# EAGLE design multi (EAGLE 9.6.2)
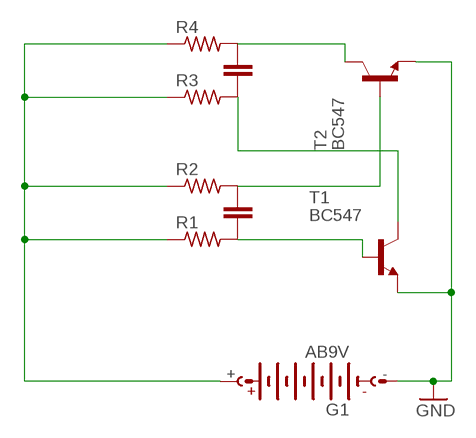
[diagram p0: schematic, sheet 1]

## Parts
G1  AB9V  [AB9V]
R1  R-US_R0805  [R0805]
R2  R-US_R0805  [R0805]
R3  R-US_R0805  [R0805]
R4  R-US_R0805  [R0805]
T1  BC547  [TO92]
T2  BC547  [TO92]

## Nets
GND: G1.- T1.1(E) T2.1(E)
N$1: G1.+ R1.1 R2.1 R3.1 R4.1
N$2: R1.2 T1.2(B)
N$4: R3.2 T1.3(C)
N$5: R2.2 T2.2(B)
N$6: R4.2 T2.3(C)

## Library data of the parts
G1 = battery:AB9V: 9-V BATTERY CLIP
R1-R4 = rcl:R-US_: RESISTOR, American symbol; SPICEPREFIX: R
T1 T2 = transistor:BC547: NPN TRANSISTOR

## Board
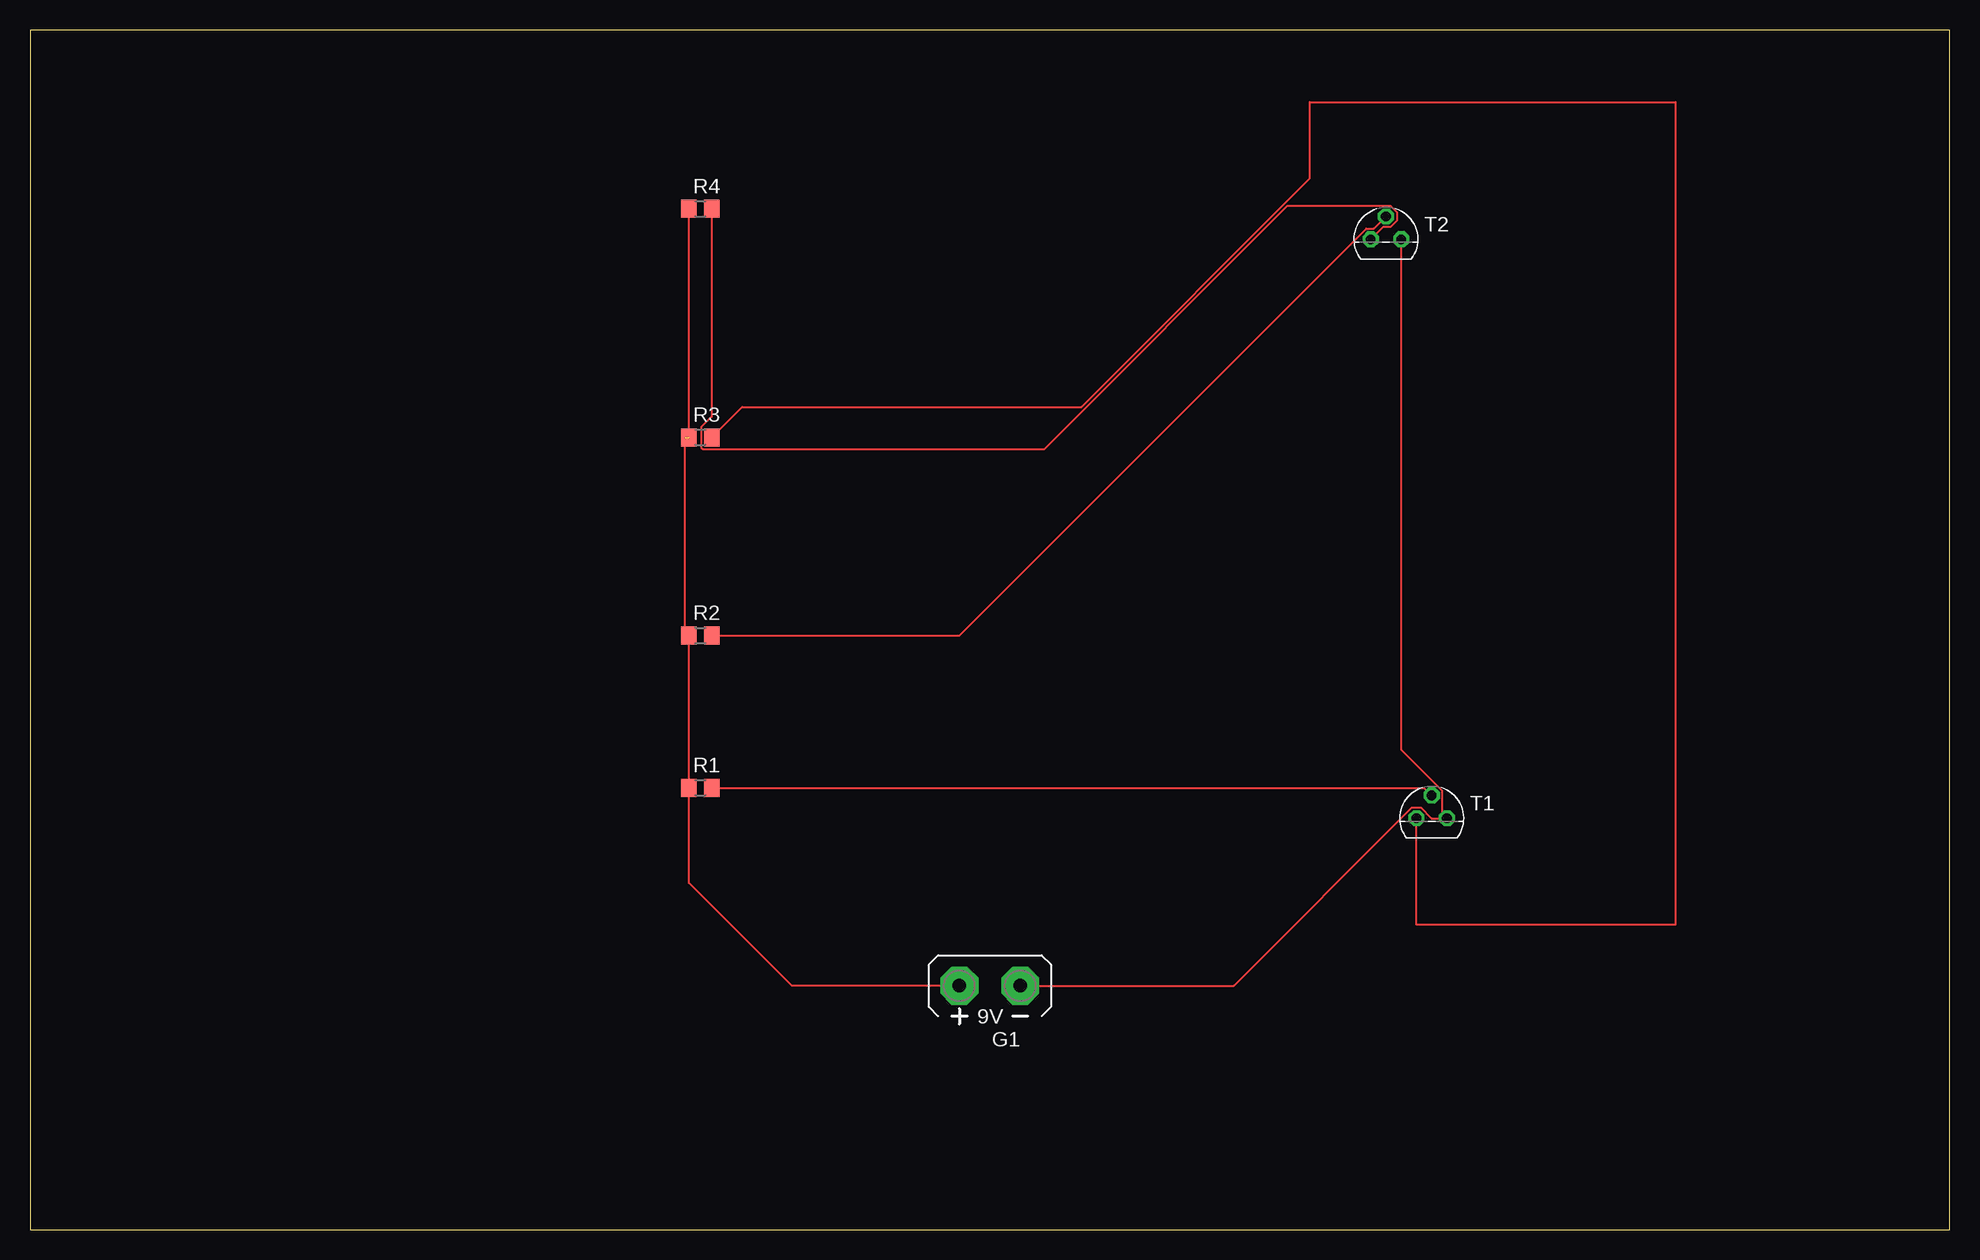
[diagram p1: board, top side]

Size 160 x 100 mm. Coordinates in mm from the lower left corner, seen from the top.
Outline: 0,0 160,0 160,100 0,100 0,0
Copper layers (1*16): Top 0.035mm / dielectric 1.5mm / Bottom 0.035mm
Design rules "default": minimum track width 6mil, minimum drill 0.35mm, track to track 6mil, track to pad 6mil, pad to pad 6mil, via to via 6mil, smd to smd 6mil, copper to edge 40mil, drill to drill 6mil, minimum pad ring 10mil, minimum via ring 8mil, stop-mask expansion 4mil, vias tented up to drill 0mil, thermal gap 10mil

### Footprints (pad centres in the part's own frame; a part is rotated, then mirrored left to right if it is on the bottom)
AB9V = drill 1.118 pad 3.15 octagon: + 0,2.54; - 0,-2.54
R0805 = smd 1.3 x 1.5: 1 -0.95,0; 2 0.95,0
TO92 = drill 0.813 octagon: 1 1.27,0; 2 0,1.905; 3 -1.27,0

### Placement (x,y rotation side)
G1  80.01,20.32 90 top
R1  55.88,36.83 0 top
R2  55.88,49.53 0 top
R3  55.88,66.04 0 top
R4  55.88,85.09 0 top
T1  116.84,34.29 0 top
T2  113.03,82.55 0 top

### Tracks (layer width: path | path; a pad name or v marks a point on that pad's centre or on a via)
GND
  Top 0.152: G1.- 100.34,20.32 115.2,35.18 115.94,35.18 116.83,34.29 T1.1 117.73,34.67 117.73,36.56 114.3,39.99 T2.1
N$1  (1 unrouted)
  Top 0.152: G1.+ 63.5,20.32 54.93,28.89 R1.1 R2.1 54.61,49.85 54.61,66.04 | R3.1 R4.1
N$2
  Top 0.152: R1.2 116.2,36.83 T1.2
N$4
  Top 0.152: R3.2 59.37,68.58 87.63,68.58 106.68,87.63 106.68,93.98 137.16,93.98 137.16,25.4 115.57,25.4 T1.3
N$5
  Top 0.152: T2.2 112.01,83.44 111.39,83.44 77.48,49.53 R2.2
N$6
  Top 0.152: T2.3 112.78,83.57 113.4,83.57 113.92,84.09 113.92,84.82 113.4,85.34 104.83,85.34 84.54,65.06 56.09,65.06 55.95,65.19 55.95,66.89 56.83,67.76 R4.2